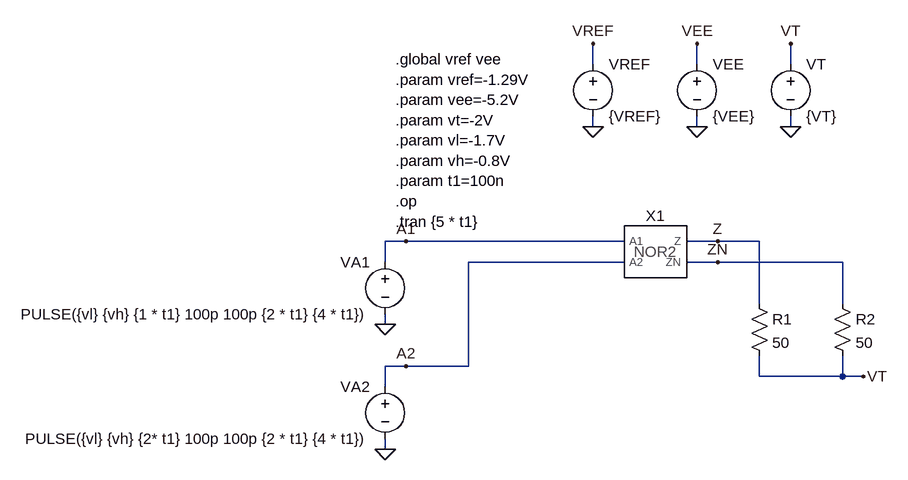
[diagram p0: schematic tb_nor2.asc]
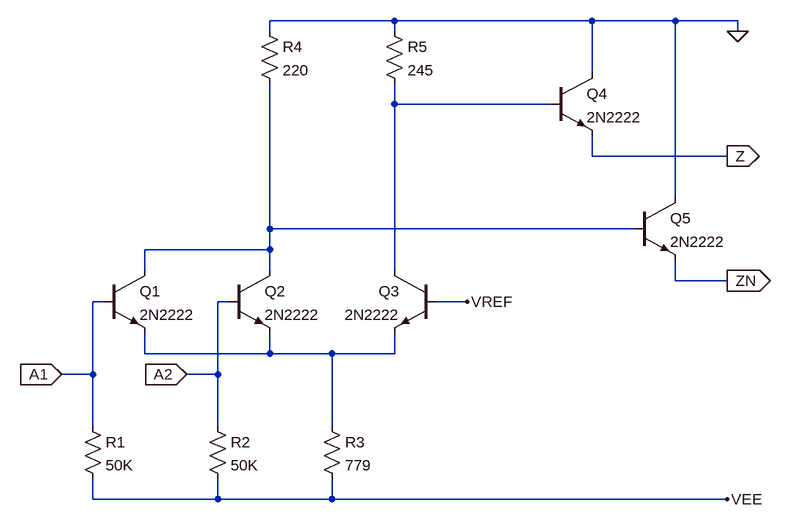
[diagram p1: sub-circuit nor2.asc]
tb_nor2.asc, the LTspice schematic file:
Version 4
SHEET 1 880 704
WIRE 352 96 352 64
WIRE 512 96 512 64
WIRE 656 96 656 64
WIRE 352 192 352 176
WIRE 512 192 512 176
WIRE 656 192 656 176
WIRE 64 368 32 368
WIRE 400 368 64 368
WIRE 544 368 496 368
WIRE 608 368 544 368
WIRE 32 400 32 368
WIRE 400 400 160 400
WIRE 544 400 496 400
WIRE 736 400 544 400
WIRE 608 464 608 368
WIRE 736 464 736 400
WIRE 32 496 32 480
WIRE 64 560 32 560
WIRE 160 560 160 400
WIRE 160 560 64 560
WIRE 608 576 608 544
WIRE 736 576 736 544
WIRE 736 576 608 576
WIRE 768 576 736 576
WIRE 32 592 32 560
WIRE 32 688 32 672
FLAG 352 192 0
FLAG 512 192 0
FLAG 352 64 VREF
FLAG 512 64 VEE
FLAG 768 576 VT
FLAG 544 368 Z
FLAG 544 400 ZN
FLAG 32 496 0
FLAG 32 688 0
FLAG 64 368 A1
FLAG 64 560 A2
FLAG 656 192 0
FLAG 656 64 VT
SYMBOL nor2 448 384 R0
SYMATTR InstName X1
SYMBOL voltage 352 80 R0
SYMATTR InstName VREF
SYMATTR Value {VREF}
SYMBOL voltage 512 80 R0
SYMATTR InstName VEE
SYMATTR Value {VEE}
SYMBOL res 592 448 R0
SYMATTR InstName R1
SYMATTR Value 50
SYMBOL res 720 448 R0
SYMATTR InstName R2
SYMATTR Value 50
SYMBOL voltage 32 384 M0
SYMATTR InstName VA1
SYMATTR Value PULSE({vl} {vh} {1 * t1} 100p 100p {2 * t1} {4 * t1})
SYMBOL voltage 32 576 M0
SYMATTR InstName VA2
SYMATTR Value PULSE({vl} {vh} {2* t1} 100p 100p {2 * t1} {4 * t1})
SYMBOL voltage 656 80 R0
SYMATTR InstName VT
SYMATTR Value {VT}
TEXT 48 88 Left 2 !.global vref vee\n.param vref=-1.29V\n.param vee=-5.2V\n.param vt=-2V\n.param vl=-1.7V\n.param vh=-0.8V\n.param t1=100n\n.op\n.tran {5 * t1}

nor2.asc, the sub-circuit schematic file:
Version 4
SHEET 1 1476 680
WIRE 544 -272 352 -272
WIRE 848 -272 544 -272
WIRE 976 -272 848 -272
WIRE 1072 -272 976 -272
WIRE 352 -256 352 -272
WIRE 544 -256 544 -272
WIRE 1072 -256 1072 -272
WIRE 848 -192 848 -272
WIRE 544 -144 544 -176
WIRE 784 -144 544 -144
WIRE 848 -64 848 -96
WIRE 1056 -64 848 -64
WIRE 976 0 976 -272
WIRE 352 48 352 -176
WIRE 912 48 352 48
WIRE 352 80 352 48
WIRE 352 80 160 80
WIRE 160 112 160 80
WIRE 352 112 352 80
WIRE 544 112 544 -144
WIRE 976 128 976 96
WIRE 1056 128 976 128
WIRE 96 160 80 160
WIRE 288 160 272 160
WIRE 656 160 608 160
WIRE 160 240 160 208
WIRE 352 240 352 208
WIRE 352 240 160 240
WIRE 448 240 352 240
WIRE 544 240 544 208
WIRE 544 240 448 240
WIRE 80 272 80 160
WIRE 80 272 32 272
WIRE 272 272 272 160
WIRE 272 272 224 272
WIRE 80 352 80 272
WIRE 272 352 272 272
WIRE 448 352 448 240
WIRE 80 464 80 432
WIRE 272 464 272 432
WIRE 272 464 80 464
WIRE 448 464 448 432
WIRE 448 464 272 464
WIRE 1056 464 448 464
FLAG 1072 -256 0
FLAG 656 160 VREF
FLAG 1056 464 VEE
FLAG 32 272 A1
IOPIN 32 272 In
FLAG 224 272 A2
IOPIN 224 272 In
FLAG 1056 128 ZN
IOPIN 1056 128 Out
FLAG 1056 -64 Z
IOPIN 1056 -64 Out
SYMBOL npn 96 112 R0
SYMATTR InstName Q1
SYMATTR Value 2N2222
SYMBOL npn 288 112 R0
SYMATTR InstName Q2
SYMATTR Value 2N2222
SYMBOL npn 608 112 M0
SYMATTR InstName Q3
SYMATTR Value 2N2222
SYMBOL res 64 336 R0
SYMATTR InstName R1
SYMATTR Value 50K
SYMBOL res 256 336 R0
SYMATTR InstName R2
SYMATTR Value 50K
SYMBOL res 432 336 R0
SYMATTR InstName R3
SYMATTR Value 779
SYMBOL res 336 -272 R0
SYMATTR InstName R4
SYMATTR Value 220
SYMBOL res 528 -272 R0
SYMATTR InstName R5
SYMATTR Value 245
SYMBOL npn 784 -192 R0
SYMATTR InstName Q4
SYMATTR Value 2N2222
SYMBOL npn 912 0 R0
SYMATTR InstName Q5
SYMATTR Value 2N2222

The netlist it stands for:
* tb_nor2.asc
XX1 A1 A2 Z ZN nor2
VREF VREF 0 {VREF}
VEE VEE 0 {VEE}
R1 Z VT 50
R2 ZN VT 50
VA1 A1 0 PULSE({vl} {vh} {1 * t1} 100p 100p {2 * t1} {4 * t1})
VA2 A2 0 PULSE({vl} {vh} {2* t1} 100p 100p {2 * t1} {4 * t1})
VT VT 0 {VT}

* block symbol definitions
.subckt nor2 A1 A2 Z ZN
Q1 N002 A1 N003 0 2N2222
Q2 N002 A2 N003 0 2N2222
Q3 N001 VREF N003 0 2N2222
R1 A1 VEE 50K
R2 A2 VEE 50K
R3 N003 VEE 779
R4 0 N002 220
R5 0 N001 245
Q4 0 N001 Z 0 2N2222
Q5 0 N002 ZN 0 2N2222
.ends nor2

.model NPN NPN
.model PNP PNP
.lib standard.bjt
.global vref vee
.param vref=-1.29V
.param vee=-5.2V
.param vt=-2V
.param vl=-1.7V
.param vh=-0.8V
.param t1=100n
.op
.tran {5 * t1}
.backanno
.end